# Altium project Programer_PCB.PrjPcb
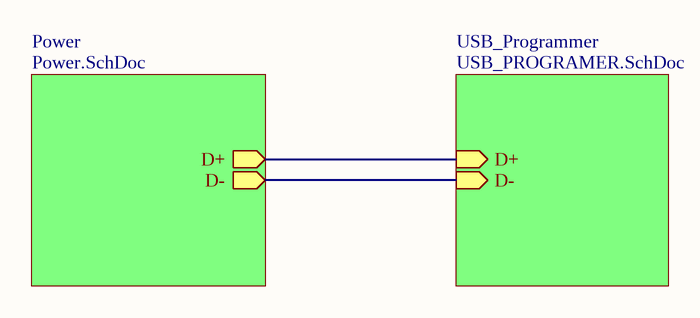
[diagram p0: Programador.SchDoc]
3 sheets, 47 parts. Net scope: hierarchical (ports join the sheet entries above them; power ports are global).
Board file: Programador_PCB.PcbDoc
Sheets:
  Programador.SchDoc
    Power = Power.SchDoc
    USB_Programmer = USB_PROGRAMER.SchDoc

## Sheet Programador.SchDoc
size A4; SheetNumber: 1; SheetTotal: 3

### Sub-sheets
Power = Power.SchDoc: D+ (out), D- (out)
USB_Programmer = USB_PROGRAMER.SchDoc: D- (in), D+ (in)

### Nets
Dataneg1: sheet Power/D-, sheet USB_Programmer/D-
Dataplus1: sheet Power/D+, sheet USB_Programmer/D+

## Sheet Power.SchDoc
size A4; SheetNumber: 3; SheetTotal: 3
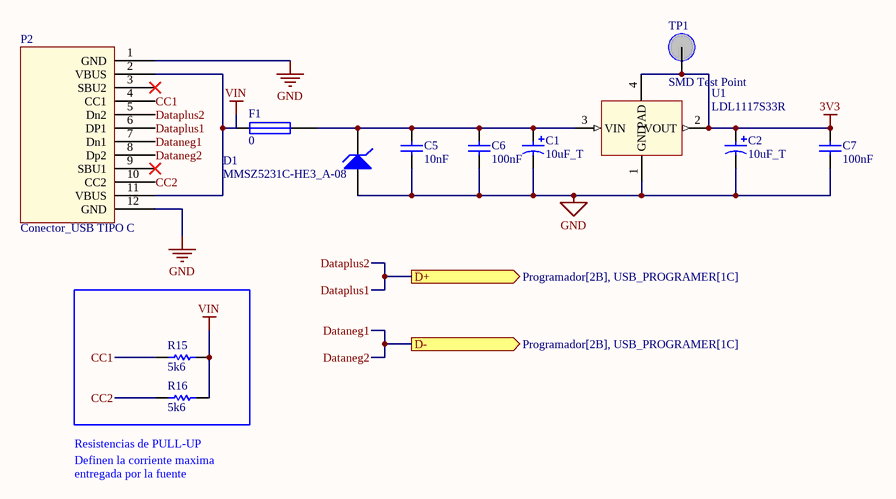
[diagram p1: Power.SchDoc]

### Parts
C1  10uF_T  [C_0805_2013_c]
C2  10uF_T  [C_0805_2013_c]
C5  10nF  [C_0805_2013_b]
C6  100nF  [C_0805_2013_b]
C7  100nF  [C_0805_2013_b]
D1  MMSZ5231C-HE3_A-08  [D_SOD-123]
F1  0  [F_0805_2012]
P2  Conector_USB TIPO C  [P_USB_C]
R15  5k6  [R_0805_2012_a]
R16  5k6  [R_0805_2012_a]
TP1  SMD Test Point  [TP SMD]
U1  LDL1117S33R  [U_SOT-223]

### Ports
D+ (out, see Programador[2B], USB_PROGRAMER[1C]), D- (out, see Programador[2B], USB_PROGRAMER[1C])

### Nets
3V3: C2.1 C7.2 TP1.1 U1.2(VOUT) U1.4(PAD)
GND: C1.2 C2.2 C5.1 C6.1 C7.1 D1.2(A) P2.1(GND) P2.12(GND) U1.1(GND)
VIN: F1.1 P2.2(VBUS) P2.11(VBUS) R15.1 R16.2
CC1: P2.4(CC1) R15.2
CC2: P2.10(CC2) R16.1
Dataneg1: P2.7(Dn1) P2.8(Dp2) ; port D-  [also labelled Dataneg2]
Dataplus1: P2.5(Dn2) P2.6(DP1) ; port D+  [also labelled Dataplus2]
NetC1_1: C1.1 C5.2 C6.2 D1.1(K) F1.2 U1.3(VIN)

Not connected (* = marked no-connect by the designer): P2 3(SBU2)* 9(SBU1)*

### Notes on the sheet
- (near R16) Resistencias de PULL-UP
- Definen la corriente maxima entregada por la fuente

### Library data of the parts
C1 C2 = C_10uF_10V_b: Capacitor SMD 0805 Tant; Manufacturer: Vishay; Manufacturer Part Number: TMCP1A106MTRF; RoHS Compliant: Yes; Supplier 1: Mouser; Supplier Part Number 1: 74-TMCP1A106MTRF; RoHS: Yes; Category: Tantalum Capacitors; Stock 1: 7293; Pricing 1: 1=0,3, 10=0,152, 50=0,152, 100=0,098, 1000=0,082, 10000=0,067 (USD); Value: 10uF_T
C5 = C_10nF_50V_b: Capacitor SMD 0805; Manufacturer: KEMET; Manufacturer Part Number: C0805C103J5RAC7210; Dielectric Material: Ceramic; Tolerance: 5%; Voltage Rating: 50V; Dielectric: X7R; Case/Package: 0805; Case Code (Imperial): 0805; Case Code (Metric): 2012; Min Operating Temperature: -55°C; Max Operating Temperature: 125°C; Packaging: Tape and Reel; Package Quantity: 10000; Voltage Rating (DC): 50V; Termination: SMD/SMT; Series: SMD Comm X7R; Length: 2mm; Lead Pitch: 0.75mm; Depth: 1.25mm; RoHS Compliant: Yes; ComponentLink1URL: http://www.mouser.com/ds/2/212/KEM_C1002_X7R_SMD-1102033.pdf?src-supplier=Mouser; ComponentLink1Description: http://www.mouser.com/ds/2/212/KEM_C1002_X7R_SMD-1102033.pdf?src-supplier=Mouser; ComponentLink2URL: http://components.arrow.com/part/dataview/3450688S9650973N7429?src-supplier=Arrow+Electronics; ComponentLink2Description: http://components.arrow.com/part/dataview/3450688S9650973N7429?src-supplier=Arrow+Electronics; ComponentLink3URL: https://datasheet.octopart.com/C0805C103J5RAC7210-KEMET-datasheet-68331906.pdf?src-supplier=Farnell; ComponentLink3Description: https://datasheet.octopart.com/C0805C103J5RAC7210-KEMET-datasheet-68331906.pdf?src-supplier=Farnell; ComponentLink4URL: https://api.kemet.com/component-edge/download/datasheet/C0805C103J5RAC7210.pdf?src-supplier=Digikey; ComponentLink4Description: https://api.kemet.com/component-edge/download/datasheet/C0805C103J5RAC7210.pdf?src-supplier=Digikey; ComponentLink5URL: https://datasheet.octopart.com/C0805C103J5RAC7210-KEMET-datasheet-37550250.pdf?src-supplier=Electro+Sonic; ComponentLink5Description: https://datasheet.octopart.com/C0805C103J5RAC7210-KEMET-datasheet-37550250.pdf?src-supplier=Electro+Sonic; ComponentLink6URL: https://datasheet.octopart.com/C0805C103J5RAC7210-KEMET-datasheet-166547538.pdf?src-supplier=TME; ComponentLink6Description: https://datasheet.octopart.com/C0805C103J5RAC7210-KEMET-datasheet-166547538.pdf?src-supplier=TME; Supplier 1: Mouser; Supplier Part Number 1: 80-C0805C103J5R7210; RoHS: Yes; Category: Ceramic Capacitors; Stock 1: 30128; Pricing 1: 1=0,1, 10=0,034, 50=0,034, 100=0,02, 1000=0,014, 10000=0,009 (USD); Value: 10nF
C6 C7 = C_100nF_50V_b: Capacitor SMD 0805; Manufacturer: Yageo; Manufacturer Part Number: CC0805KRX7R9BB104; Material: Ceramic; Tolerance: 10%; Dielectric: X7R; Voltage: 50V; Insulation Resistance: 100GR; Mounting Technology: Surface Mount; Case/Package: 0805; Pins: 2; Case Code (Metric): 2012; Case Code (Imperial): 0805; Min Operating Temperature: -55°C; Max Operating Temperature: 125°C; Packaging: Tape and Reel; Voltage Rating: 50V; Package Quantity: 4000; Termination: SMD/SMT; Series: CC; Length: 2mm; Height: 0.85mm; Depth: 1.25mm; Radiation Hardening: No; RoHS Compliant: Yes; Reach SVHC Compliant: No; Halogen Free: 5694HalogenFree; Lead Free: 5697LeadFree; ComponentLink1URL: https://datasheet.ciiva.com/11786/0900766b80d84f1d-11786009.pdf?src-supplier=Rs; ComponentLink1Description: https://datasheet.ciiva.com/11786/0900766b80d84f1d-11786009.pdf?src-supplier=Rs; ComponentLink2URL: https://datasheet.ciiva.com/46393/1734573-46393307.pdf?src-supplier=Element14; ComponentLink2Description: https://datasheet.ciiva.com/46393/1734573-46393307.pdf?src-supplier=Element14; ComponentLink3URL: https://datasheet.ciiva.com/155/mlccorderingcode-155930.pdf?src-supplier=Digikey; ComponentLink3Description: https://datasheet.ciiva.com/155/mlccorderingcode-155930.pdf?src-supplier=Digikey; ComponentLink4URL: https://datasheet.ciiva.com/155/mlccorderingcode-155929.pdf?src-supplier=Digikey; ComponentLink4Description: https://datasheet.ciiva.com/155/mlccorderingcode-155929.pdf?src-supplier=Digikey; ComponentLink5URL: https://datasheet.ciiva.com/155/mlccorderingcode-155931.pdf?src-supplier=Digikey; ComponentLink5Description: https://datasheet.ciiva.com/155/mlccorderingcode-155931.pdf?src-supplier=Digikey; ComponentLink6URL: https://datasheet.ciiva.com/11464/upy-gphc-x7r-6-3v-to-50v-8-11464757.pdf?src-supplier=Avnet; ComponentLink6Description: https://datasheet.ciiva.com/11464/upy-gphc-x7r-6-3v-to-50v-8-11464757.pdf?src-supplier=Avnet; ComponentLink7URL: https://datasheet.ciiva.com/28450/1489800-28450805.pdf?src-supplier=Element14; ComponentLink7Description: https://datasheet.ciiva.com/28450/1489800-28450805.pdf?src-supplier=Element14; ComponentLink8URL: https://datasheet.ciiva.com/29242/445210-da-01-en-kerko-chip-0805-x7r-0-1uf-10proz-50vg-29242074.pdf?src-supplier=Conrad; ComponentLink8Description: https://datasheet.ciiva.com/29242/445210-da-01-en-kerko-chip-0805-x7r-0-1uf-10proz-50vg-29242074.pdf?src-supplier=Conrad; Supplier 1: Digikey; Supplier Part Number 1: 311-1140-1-ND; RoHS: Yes; Category: Ceramic Capacitors; Stock 1: 5306374; Pricing 1: 1=0,1, 10=0,07, 50=0,0418, 100=0,0329, 500=0,02428, 1000=0,0201 (USD); Value: 100nF
D1 = D_MMSZ5231C-HE3_A-08: Diode SMD SOD-123 Zener 5V1; Manufacturer: Vishay Semiconductors; Manufacturer Part Number: MMSZ5226C-E3-08; Zener Voltage: 3.3V; Max Power Dissipation: 500mW; Impedance: 28R; Zener Current: 20mA; Voltage Tolerance: 2%; Max Reverse Leakage Current: 25uA; Mounting Technology: Surface Mount; Weight: 0.000363oz; Min Operating Temperature: -55°C; Max Operating Temperature: 150°C; Packaging: Tape and Reel; Package Quantity: 3000; Power Dissipation: 500mW; Tolerance: 2%; Series: Automotive, AEC-Q101; RoHS Compliant: Yes; ComponentLink1URL: https://www.vishay.com/docs/86344/mmsz5225_to_mmsz5267.pdf; ComponentLink1Description: Datasheet; RoHS: Yes; Category: Zener Diodes; Stock 1: 14347; Pricing 1: 1=0,29, 10=0,198, 50=0,198, 100=0,089, 1000=0,062, 10000=0,041 (USD); Value: MMSZ5231C-HE3_A-08; Supplier 1: Mouser; Supplier Part Number 1: 78-MMSZ5231CHE3_A-08
F1 = F_?_0805: (Generico) Fuse SMD 0805; Origin: TAIWAN; Published: 8-Jun-2000; LatestRevisionDate: 17-Jul-2002; LatestRevisionNote: Re-released for DXP Platform.; PackageReference: PIN-W2/E2.8; Publisher: Altium Limited; PackageDescription: Thru-Hole; 2 Leads; Supplier 1: Digi-Key; Supplier Part Number 1: SF-1206S200-2CT-ND; Value: 0
P2 = P_USB_C: Conector USB tip C basico; Value: Conector_USB TIPO C; Supplier 1: Mouser; Supplier Part Number 1: 179-UJ20CHGSMT1P16TR
R15 R16 = R_5k6_b: Resistor SMD 0805; Manufacturer: TE Connectivity; Manufacturer Part Number: CRG0805F5K6; Tolerance: 1%; Temperature Coefficient: 100ppm/°C; Power Rating: 125mW; Voltage Rating: 150V; Number of Resistors: 1; Mounting Technology: Surface Mount; Case/Package: 0805; Case Code (Imperial): 0805; Case Code (Metric): 2012; Min Operating Temperature: -55°C; Max Operating Temperature: 125°C; Packaging: Tape and Reel; Number of Terminations: 2; Series: CRG; Resistor Type: Thick Film; Termination: Solder; Technology: THICK FILM; Length: 2mm; Width: 1.25mm; Height: 0.55mm; Depth: 1.25mm; RoHS Compliant: Yes; ELV: Compliant; ComponentLink1URL: https://datasheet.ciiva.com/11809/0900766b800a696e-11809932.pdf?src-supplier=Rs; ComponentLink1Description: https://datasheet.ciiva.com/11809/0900766b800a696e-11809932.pdf?src-supplier=Rs; ComponentLink2URL: https://datasheet.ciiva.com/12563/eng-ds-1773204-g-12563327.pdf?src-supplier=Mouser; ComponentLink2Description: https://datasheet.ciiva.com/12563/eng-ds-1773204-g-12563327.pdf?src-supplier=Mouser; Supplier 1: Digikey; Supplier Part Number 1: A126380CT-ND; RoHS: Yes; Stock 1: 44154; Pricing 1: 1=0,1, 10=0,034, 50=0,0218, 100=0,0182, 500=0,01264, 1000=0,01093 (USD); Value: 5k6
TP1 = P_T_TP: Test Point SMD; Origin: CHINA; Published: 8-Jun-2000; LatestRevisionDate: 17-Jul-2002; LatestRevisionNote: Re-released for DXP Platform.; PackageReference: AXIAL-0.3; Publisher: Altium Limited; PackageDescription: Axial Device, Thru-Hole; 2 Leads; 0.3 in Pin Spacing; Supplier 1: Mouser; Supplier Part Number 1: 279-RCT-0C; Type: CONNECTOR; Value: SMD Test Point
U1 = U_LDL1117: LDL1117 Series 1.2 A 2.5 V High PSRR LDO Linear Voltage Regulator-SOT-223; Manufacturer: STMicroelectronics; Manufacturer Part Number: LDL1117S25R; Output Type: Fixed; Output Configuration: Positive; Number of Regulators: 1; Max Supply Voltage: 18V; Min Output Voltage: 2.5V; Output Current: 1.2A; Quiescent Current: 500uA; Power Supply Rejection Ratio (PSRR): 65dB; Accuracy: 2%; Min Supply Voltage: 2.6V; Nominal Supply Current: 250uA; Number of Channels: 1NUMBER; Value: LDL1117S25R; Mounting Technology: Surface Mount; Case/Package: TO-261-4; Min Operating Temperature: -40°C; Max Operating Temperature: 125°C; Packaging: Cut Tape; Series: -; Number of Outputs: 1NUMBER; Output Voltage: 2.5V; Height: 1.8mm; RoHS Compliant: Yes; ComponentLink1URL: http://www.farnell.com/datasheets/2342741.pdf?src-supplier=Farnell; ComponentLink1Description: http://www.farnell.com/datasheets/2342741.pdf?src-supplier=Farnell; ComponentLink2URL: http://www.st.com/content/ccc/resource/technical/document/datasheet/group3/0e/5a/00/ca/10/1a/4f/a5/DM00366442/files/DM00366442.pdf/jcr:content/translations/en.DM00366442.pdf?src-supplier=Digikey; ComponentLink2Description: http://www.st.com/content/ccc/resource/technical/document/datasheet/group3/0e/5a/00/ca/10/1a/4f/a5/DM00366442/files/DM00366442.pdf/jcr:content/translations/en.DM00366442.pdf?src-supplier=Digikey; ComponentLink3URL: https://datasheet.octopart.com/LDL1117S25R-STMicroelectronics-datasheet-165583407.pdf?src-supplier=TME; ComponentLink3Description: https://datasheet.octopart.com/LDL1117S25R-STMicroelectronics-datasheet-165583407.pdf?src-supplier=TME; Supplier 1: Mouser; Supplier Part Number 1: 511-LDL1117S25R; RoHS: Yes; Category: Voltage Regulators - Linear; Stock 1: 10345; Pricing 1: 1=1,1, 10=0,98, 50=0,935, 100=0,757, 1000=0,478, 10000=0,415 (USD)

## Sheet USB_PROGRAMER.SchDoc
size A4; SheetNumber: 2; SheetTotal: 3
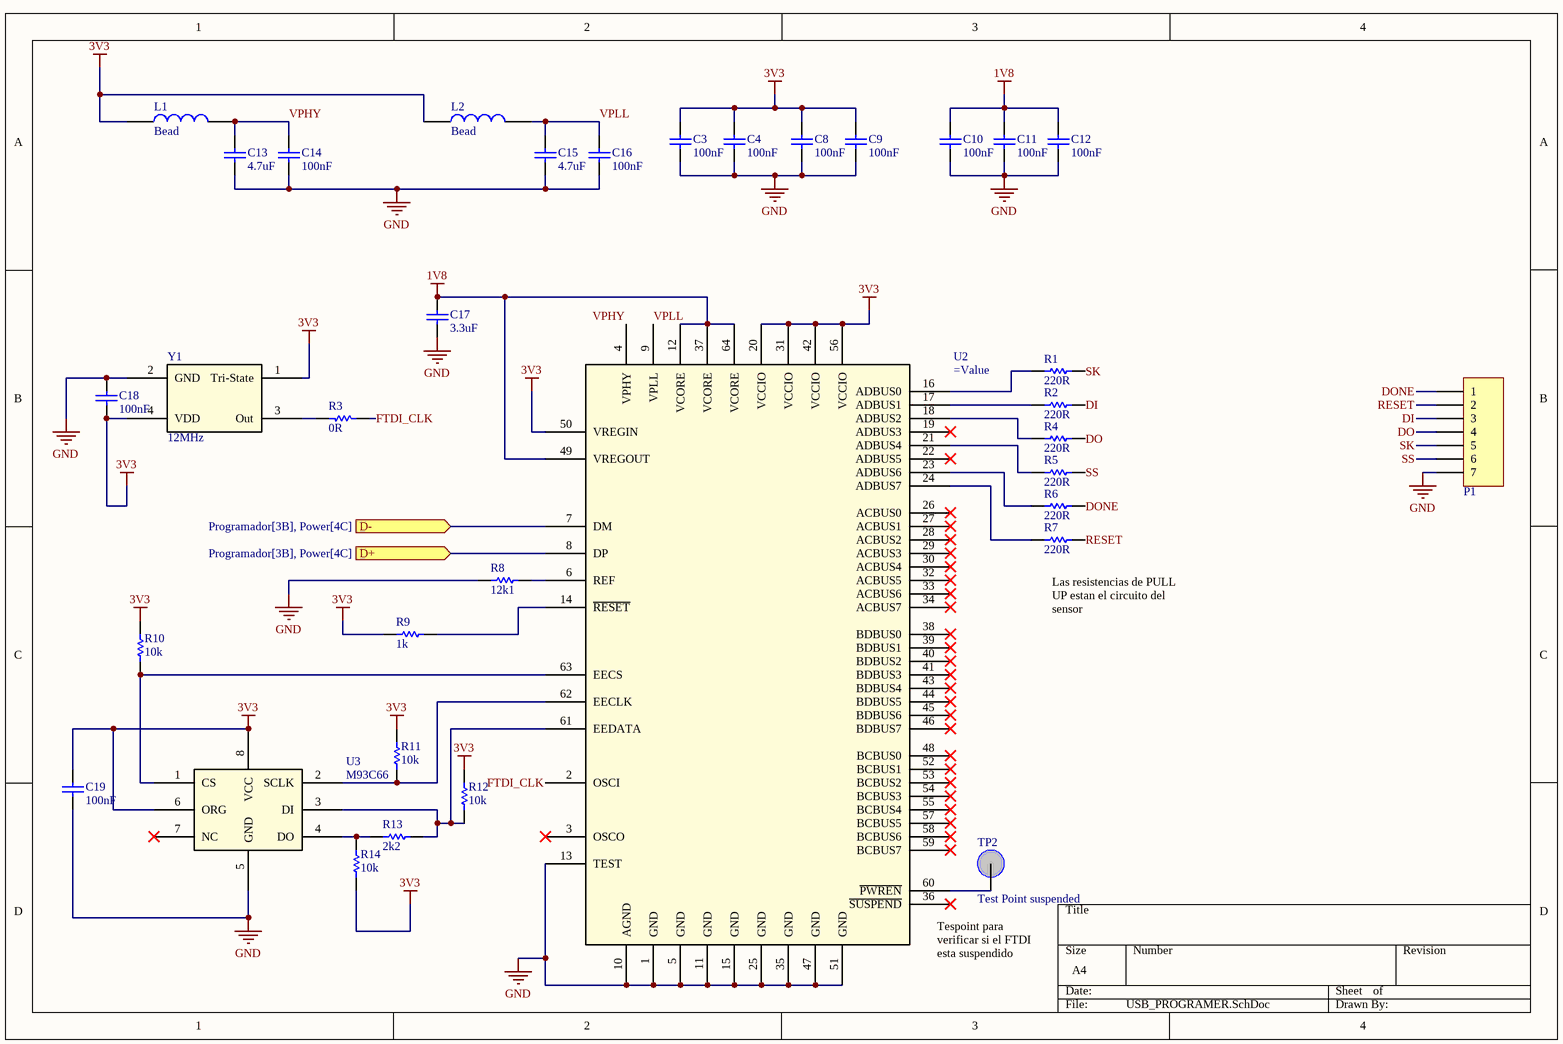
[diagram p2: USB_PROGRAMER.SchDoc]

### Parts
C3  100nF  [C_0805_2013_b]
C4  100nF  [C_0805_2013_b]
C8  100nF  [C_0805_2013_b]
C9  100nF  [C_0805_2013_b]
C10  100nF  [C_0805_2013_b]
C11  100nF  [C_0805_2013_b]
C12  100nF  [C_0805_2013_b]
C13  4.7uF  [C_0805_2013_b]
C14  100nF  [C_0805_2013_b]
C15  4.7uF  [C_0805_2013_b]
C16  100nF  [C_0805_2013_b]
C17  3.3uF  [C_0805_2013_b]
C18  100nF  [C_0805_2013_b]
C19  100nF  [C_0805_2013_b]
L1  Bead  [L_0805_2013]
L2  Bead  [L_0805_2013]
P1  BORNERA 6 ENCH  [P_CON1X7]  (value not drawn)
R1  220R  [R_0805_2012_a]
R2  220R  [R_0805_2012_a]
R3  0R  [R_0805_2012_a]
R4  220R  [R_0805_2012_a]
R5  220R  [R_0805_2012_a]
R6  220R  [R_0805_2012_a]
R7  220R  [R_0805_2012_a]
R8  12k1  [R_0805_2012_a]
R9  1k  [R_0805_2012_a]
R10  10k  [R_0805_2012_a]
R11  10k  [R_0805_2012_a]
R12  10k  [R_0805_2012_a]
R13  2k2  [R_0805_2012_a]
R14  10k  [R_0805_2012_a]
TP2  Test Point suspended  [TP SMD]
U2  (no value)  [U_TQFP-64]
U3  M93C66  [U_SO-8]
Y1  12MHz  [Y_SMD-XTAL-12MHz]

### Ports
D+ (in, see Programador[3B], Power[4C]), D- (in, see Programador[3B], Power[4C])

### Nets
1V8: C10.2 C11.2 C12.2 C17.2 U2.12(VCORE) U2.37(VCORE) U2.49(VREGOUT) U2.64(VCORE)
3V3: C3.2 C4.2 C8.2 C9.2 C18.1 C19.2 L1.1 L2.1 R9.1 R10.2 R11.2 R12.2 R14.1 U2.20(VCCIO) U2.31(VCCIO) U2.42(VCCIO) U2.50(VREGIN) U2.56(VCCIO) U3.6(ORG) U3.8(VCC) Y1.1(Tri-State) Y1.4(VDD)
GND: C3.1 C4.1 C8.1 C9.1 C10.1 C11.1 C12.1 C13.1 C14.1 C15.1 C16.1 C17.1 C18.2 C19.1 P1.7 R8.1 U2.1(GND) U2.5(GND) U2.10(AGND) U2.11(GND) U2.13(TEST) U2.15(GND) U2.25(GND) U2.35(GND) U2.47(GND) U2.51(GND) U3.5(GND) Y1.2(GND)
Dataneg1: U2.7(DM) ; port D-
Dataplus1: U2.8(DP) ; port D+
DI: P1.3 R2.2
DO: P1.4 R4.2
DONE: P1.1 R6.2
FTDI_CLK: R3.1 U2.2(OSCI)
RESET: P1.2 R7.2
SK: P1.5 R1.2
SS: P1.6 R5.2
VPHY: C13.2 C14.2 L1.2 U2.4(VPHY)
VPLL: C15.2 C16.2 L2.2 U2.9(VPLL)
NetR1_1: R1.1 U2.16(ADBUS0)
NetR2_1: R2.1 U2.17(ADBUS1)
NetR3_2: R3.2 Y1.3(Out)
NetR4_1: R4.1 U2.18(ADBUS2)
NetR5_1: R5.1 U2.21(ADBUS4)
NetR6_1: R6.1 U2.23(ADBUS6)
NetR7_1: R7.1 U2.24(ADBUS7)
NetR8_2: R8.2 U2.6(REF)
NetR9_2: R9.2 U2.14(~{RESET})
NetR10_1: R10.1 U2.63(EECS) U3.1(CS)
NetR11_1: R11.1 U2.62(EECLK) U3.2(SCLK)
NetR12_1: R12.1 R13.2 U2.61(EEDATA) U3.3(DI)
NetR13_1: R13.1 R14.2 U3.4(DO)
NetTP2_1: TP2.1 U2.60(~{PWREN})

Not connected (* = marked no-connect by the designer): U2 3(OSCO)* 19(ADBUS3)* 22(ADBUS5)* 26(ACBUS0)* 27(ACBUS1)* 28(ACBUS2)* 29(ACBUS3)* 30(ACBUS4)* 32(ACBUS5)* 33(ACBUS6)* 34(ACBUS7)* 36(~{SUSPEND})* 38(BDBUS0)* 39(BDBUS1)* 40(BDBUS2)* 41(BDBUS3)* 43(BDBUS4)* 44(BDBUS5)* 45(BDBUS6)* 46(BDBUS7)* 48(BCBUS0)* 52(BCBUS1)* 53(BCBUS2)* 54(BCBUS3)* 55(BCBUS4)* 57(BCBUS5)* 58(BCBUS6)* 59(BCBUS7)*; U3 7(NC)*

### Notes on the sheet
- (near R7) Las resistencias de PULL UP estan el circuito del sensor
- (near U2) Tespoint para verificar si el FTDI esta suspendido

### Library data of the parts
C3 C4 C8-C12 C14 C16 C18 C19 = C_100nF_50V_b: as C6 on sheet Power; Mounting Technology: Surface Mount; Case/Package: 0805; Pins: 2; Case Code (Metric): 2012; Case Code (Imperial): 0805; Min Operating Temperature: -55°C; Max Operating Temperature: 125°C; Packaging: Tape and Reel; Voltage Rating: 50V; Package Quantity: 4000; Termination: SMD/SMT; Series: CC; Length: 2mm; Height: 0.85mm; Depth: 1.25mm; Radiation Hardening: No; RoHS Compliant: Yes; Reach SVHC Compliant: No; Halogen Free: 5694HalogenFree; Lead Free: 5697LeadFree; ComponentLink1URL: https://datasheet.ciiva.com/11786/0900766b80d84f1d-11786009.pdf?src-supplier=Rs; ComponentLink1Description: https://datasheet.ciiva.com/11786/0900766b80d84f1d-11786009.pdf?src-supplier=Rs; ComponentLink2URL: https://datasheet.ciiva.com/46393/1734573-46393307.pdf?src-supplier=Element14; ComponentLink2Description: https://datasheet.ciiva.com/46393/1734573-46393307.pdf?src-supplier=Element14; ComponentLink3URL: https://datasheet.ciiva.com/155/mlccorderingcode-155930.pdf?src-supplier=Digikey; ComponentLink3Description: https://datasheet.ciiva.com/155/mlccorderingcode-155930.pdf?src-supplier=Digikey; ComponentLink4URL: https://datasheet.ciiva.com/155/mlccorderingcode-155929.pdf?src-supplier=Digikey; ComponentLink4Description: https://datasheet.ciiva.com/155/mlccorderingcode-155929.pdf?src-supplier=Digikey; ComponentLink5URL: https://datasheet.ciiva.com/155/mlccorderingcode-155931.pdf?src-supplier=Digikey; ComponentLink5Description: https://datasheet.ciiva.com/155/mlccorderingcode-155931.pdf?src-supplier=Digikey; ComponentLink6URL: https://datasheet.ciiva.com/11464/upy-gphc-x7r-6-3v-to-50v-8-11464757.pdf?src-supplier=Avnet; ComponentLink6Description: https://datasheet.ciiva.com/11464/upy-gphc-x7r-6-3v-to-50v-8-11464757.pdf?src-supplier=Avnet; ComponentLink7URL: https://datasheet.ciiva.com/28450/1489800-28450805.pdf?src-supplier=Element14; ComponentLink7Description: https://datasheet.ciiva.com/28450/1489800-28450805.pdf?src-supplier=Element14; ComponentLink8URL: https://datasheet.ciiva.com/29242/445210-da-01-en-kerko-chip-0805-x7r-0-1uf-10proz-50vg-29242074.pdf?src-supplier=Conrad; ComponentLink8Description: https://datasheet.ciiva.com/29242/445210-da-01-en-kerko-chip-0805-x7r-0-1uf-10proz-50vg-29242074.pdf?src-supplier=Conrad; Supplier 1: Digikey; Supplier Part Number 1: 311-1140-1-ND; RoHS: Yes; Category: Ceramic Capacitors; Stock 1: 5306374; Pricing 1: 1=0,1, 10=0,07, 50=0,0418, 100=0,0329, 500=0,02428, 1000=0,0201 (USD); Value: 100nF
C13 C15 = C_4.7uF_10V_b: (Modificar) Capacitor SMD 0805; Value: 4.7uF
C17 = C_?F_?_b: (Generico) Capacitor SMD 0805; Value: 0
L1 L2 = L_Bead: Inductor SMD 0805; Manufacturer: Pulse; Manufacturer Part Number: PE-0805PFB600ST; Number of Lines: 1; Max Current Rating: 3A; Mounting Technology: Surface Mount; Case/Package: 0805; Case Code (Metric): 2012; Case Code (Imperial): 0805; Min Operating Temperature: -40°C; Max Operating Temperature: 105°C; Package Quantity: 4000; Packaging: Cut Tape; Series: PFB; Length: 0.079inch; Width: 0.049inch; Height: 0.041inch; RoHS Compliant: Yes; ComponentLink1URL: https://productfinder.pulseeng.com/doc_type/WEB301/doc_num/WC706/doc_part/WC706.pdf?src-supplier=Digikey; ComponentLink1Description: https://productfinder.pulseeng.com/doc_type/WEB301/doc_num/WC706/doc_part/WC706.pdf?src-supplier=Digikey; ComponentLink2URL: http://productfinder.pulseeng.com/products/datasheets/WC706.pdf?src-supplier=Digikey; ComponentLink2Description: http://productfinder.pulseeng.com/products/datasheets/WC706.pdf?src-supplier=Digikey; Supplier 1: Mouser; Supplier Part Number 1: 673-PE-0805PFB600ST; RoHS: Yes; Category: Ferrite Beads and Chips; Stock 1: 58506; Pricing 1: 1=0,1, 10=0,051, 50=0,051, 100=0,035, 1000=0,025, 10000=0,02 (USD); Value: Bead
P1 = P_BORNERA 7: Bornera 7; Value: BORNERA 6 ENCH
R1 R2 R4-R7 = R_220R_b: Resistor SMD 0805; Manufacturer: Bourns; Manufacturer Part Number: CR0805-FX-2200ELF; Tolerance: 1%; Power Rating: 125mW; Voltage Rating: 150V; Temperature Coefficient: 100ppm/°C; Mounting Technology: Surface Mount; Case/Package: 0805; Case Code (Metric): 2012; Case Code (Imperial): 0805; Contact Plating: Tin; Min Operating Temperature: -55°C; Max Operating Temperature: 155°C; Package Quantity: 5000; Packaging: Tape and Reel; Number of Terminations: 2; Termination: SMD/SMT; Max Power Dissipation: 125mW; Features: Moisture Resistant; Series: CR0805; Length: 2mm; Width: 1.25mm; Height: 0.5mm; Thickness: 508um; Radiation Hardening: No; RoHS Compliant: Yes; ComponentLink1URL: https://datasheet.ciiva.com/5540/chpreztr-5540846.pdf?src-supplier=Mouser; ComponentLink1Description: https://datasheet.ciiva.com/5540/chpreztr-5540846.pdf?src-supplier=Mouser; Supplier 1: Digikey; Supplier Part Number 1: CR0805-FX-2200ELFCT-ND; RoHS: Yes; Category: Chip SMD Resistors; Stock 1: 162372; Pricing 1: 1=0,1, 10=0,021, 50=0,0132, 100=0,011, 500=0,00744, 1000=0,00639 (USD); Value: 220R
R3 = R_0R_b: Resistor SMD 0805; Manufacturer: Stackpole Electronics; Manufacturer Part Number: RMCF0805ZT0R00; Power Rating: 125mW; Temperature Coefficient: 200ppm/°C; Voltage Rating: 150V; Mounting Technology: Surface Mount; Case/Package: 0805; Case Code (Metric): 2012; Case Code (Imperial): 0805; Contact Plating: Tin,Matte; Min Operating Temperature: -55°C; Max Operating Temperature: 155°C; Packaging: Tape and Reel; Number of Terminations: 2; Max Power Dissipation: 125mW; Features: Automotive AEC-Q200; Series: RMCF; Construction: Rectangular; Length: 2mm; Width: 0.049inch; Height: 0.026inch; Depth: 1.25mm; Ratings: AEC-Q200; Radiation Hardening: No; Lead Free: Lead Free; Military Standard: Not; RoHS Compliant: Yes; ComponentLink1URL: https://datasheet.ciiva.com/15193/getdatasheetpartid-360417-15193658.pdf?src-supplier=Verical; ComponentLink1Description: https://datasheet.ciiva.com/15193/getdatasheetpartid-360417-15193658.pdf?src-supplier=Verical; Supplier 1: Digikey; Supplier Part Number 1: RMCF0805ZT0R00CT-ND; RoHS: Yes; Category: Chip SMD Resistors; Stock 1: 1321891; Pricing 1: 1=0,1, 10=0,017, 25=0,0128, 50=0,0096, 100=0,0068, 250=0,00544, 500=0,00436, 1000=0,00321 (USD); Value: 0R
R8 = R_12k1_b: Resistor SMD 0805; Manufacturer: Stackpole Electronics; Manufacturer Part Number: RMCF0805FT12K1; Tolerance: 1%; Power Rating: 125mW; Temperature Coefficient: 100ppm/°C; Mounting Technology: Surface Mount; Case/Package: 0805; Case Code (Metric): 2012; Case Code (Imperial): 0805; Contact Plating: Tin,Matte; Min Operating Temperature: -55°C; Max Operating Temperature: 155°C; Packaging: Tape and Reel; Number of Terminations: 2; Max Power Dissipation: 125mW; Features: Automotive AEC-Q200; Series: RMCF; Construction: Rectangular; Length: 0.079inch; Width: 0.049inch; Height: 0.026inch; Depth: 1.25mm; Ratings: AEC-Q200; Radiation Hardening: No; Lead Free: Lead Free; Military Standard: Not; RoHS Compliant: Yes; ComponentLink1URL: https://datasheet.ciiva.com/15193/getdatasheetpartid-483936-15193530.pdf?src-supplier=Verical; ComponentLink1Description: https://datasheet.ciiva.com/15193/getdatasheetpartid-483936-15193530.pdf?src-supplier=Verical; Supplier 1: Digikey; Supplier Part Number 1: RMCF0805FT12K1CT-ND; RoHS: Yes; Category: Chip SMD Resistors; Stock 1: 644845; Pricing 1: 1=0,1, 10=0,02, 50=0,0124, 100=0,0103, 500=0,007, 1000=0,00601 (USD); Value: 12k1
R9 = R_1k_b: Resistor SMD 0805; Manufacturer: Bourns; Manufacturer Part Number: CR0805-FX-1001ELF; Tolerance: 1%; Temperature Coefficient: 100ppm/°C; Power Rating: 125mW; Voltage Rating: 150V; Mounting Technology: Surface Mount; Case/Package: 0805; Pins: 2; Contact Plating: Tin; Case Code (Imperial): 0805; Case Code (Metric): 2012; Min Operating Temperature: -55°C; Max Operating Temperature: 155°C; Resistor Type: Thick Film; Packaging: Tape and Reel; Package Quantity: 5000; Termination: SMD/SMT; Number of Terminations: 2; Max Power Dissipation: 125mW; Voltage Rating (DC): 150V; Features: Moisture Resistant; Series: CR0805; Resistance Tolerance: 1%; Technology: THICK FILM; Length: 2mm; Width: 1.25mm; Height: 0.5mm; Depth: 1.25mm; Thickness: 508um; Radiation Hardening: No; Reach SVHC Compliant: No; RoHS Compliant: Yes; ComponentLink1URL: https://datasheet.ciiva.com/11810/0900766b80fcdb72-11810305.pdf?src-supplier=Rs; ComponentLink1Description: https://datasheet.ciiva.com/11810/0900766b80fcdb72-11810305.pdf?src-supplier=Rs; ComponentLink2URL: https://datasheet.ciiva.com/27049/775383-27049976.pdf?src-supplier=Jameco; ComponentLink2Description: https://datasheet.ciiva.com/27049/775383-27049976.pdf?src-supplier=Jameco; ComponentLink3URL: https://datasheet.ciiva.com/7986/1856384-7986222.pdf?src-supplier=Element14; ComponentLink3Description: https://datasheet.ciiva.com/7986/1856384-7986222.pdf?src-supplier=Element14; ComponentLink4URL: https://datasheet.ciiva.com/9123/chpreztr-9123643.pdf?src-supplier=Avnet; ComponentLink4Description: https://datasheet.ciiva.com/9123/chpreztr-9123643.pdf?src-supplier=Avnet; ComponentLink5URL: https://datasheet.ciiva.com/6547/chpreztr-6547422.pdf?src-supplier=Digikey; ComponentLink5Description: https://datasheet.ciiva.com/6547/chpreztr-6547422.pdf?src-supplier=Digikey; ComponentLink6URL: https://datasheet.ciiva.com/6547/chpreztr-6547423.pdf?src-supplier=Digikey; ComponentLink6Description: https://datasheet.ciiva.com/6547/chpreztr-6547423.pdf?src-supplier=Digikey; ComponentLink7URL: https://datasheet.ciiva.com/6547/chpreztr-6547421.pdf?src-supplier=Digikey; ComponentLink7Description: https://datasheet.ciiva.com/6547/chpreztr-6547421.pdf?src-supplier=Digikey; ComponentLink8URL: https://datasheet.ciiva.com/30129/159chpreztr-30129981.pdf?src-supplier=Onlinecomponents.com; ComponentLink8Description: https://datasheet.ciiva.com/30129/159chpreztr-30129981.pdf?src-supplier=Onlinecomponents.com; ComponentLink9URL: https://datasheet.ciiva.com/46394/691949-46394380.pdf?src-supplier=Element14; ComponentLink9Description: https://datasheet.ciiva.com/46394/691949-46394380.pdf?src-supplier=Element14; ComponentLink10URL: https://datasheet.ciiva.com/16722/70154685-16722677.pdf?src-supplier=Allied+Electronics; ComponentLink10Description: https://datasheet.ciiva.com/16722/70154685-16722677.pdf?src-supplier=Allied+Electronics; ComponentLink11URL: https://datasheet.ciiva.com/48692/001055506-da-01-en-smd-wid-cr0805-fx-1001elf-1k-ohm-1-8w-48692106.pdf?src-supplier=Conrad; ComponentLink11Description: https://datasheet.ciiva.com/48692/001055506-da-01-en-smd-wid-cr0805-fx-1001elf-1k-ohm-1-8w-48692106.pdf?src-supplier=Conrad; Supplier 1: Digikey; Supplier Part Number 1: CR0805-FX-1001ELFCT-ND; RoHS: Yes; Category: Chip SMD Resistors; Stock 1: 453972; Pricing 1: 1=0,1, 10=0,021, 50=0,0132, 100=0,011, 500=0,00744, 1000=0,00639 (USD); Value: 1k
R10-R12 R14 = R_10k_b: Resistor SMD 0805; Manufacturer: Yageo; Manufacturer Part Number: AC0805FR-0710KL; Tolerance: 1%; Power Rating: 125mW; Voltage Rating: 150V; Temperature Coefficient: 100ppm/°C; Case/Package: 0805; Case Code (Metric): 2012; Case Code (Imperial): 0805; Min Operating Temperature: -55°C; Max Operating Temperature: 155°C; Packaging: Tape and Reel; Package Quantity: 1; Number of Terminations: 2; Termination: SMD/SMT; Max Power Dissipation: 125mW; Features: Moisture Resistant,Automotive AEC-Q200,Anti-Sulfur; Series: AC; Construction: Rectangular; Length: 0.079inch; Width: 0.049inch; Height: 0.024inch; Depth: 1.25mm; Military Standard: Not; Lead Free: Lead Free; RoHS Compliant: Yes; ComponentLink1URL: http://www.yageo.com/NewPortal/yageodocoutput?fileName=/pdf/R-Chip/PYu-AC_51_RoHS_L_6.pdf&src-supplier=Digikey; ComponentLink1Description: http://www.yageo.com/NewPortal/yageodocoutput?fileName=/pdf/R-Chip/PYu-AC_51_RoHS_L_6.pdf&src-supplier=Digikey; ComponentLink2URL: http://www.yageo.com/documents/recent/PYu-AC_51_RoHS_L_2_revised.pdf?src-supplier=Future+Electronics; ComponentLink2Description: http://www.yageo.com/documents/recent/PYu-AC_51_RoHS_L_2_revised.pdf?src-supplier=Future+Electronics; ComponentLink3URL: http://www.yageo.com/NewPortal/yageodocoutput?fileName=/pdf/R-Chip/PYu-AC_51_RoHS_L_6.pdf&src-supplier=NAC+Semi; ComponentLink3Description: http://www.yageo.com/NewPortal/yageodocoutput?fileName=/pdf/R-Chip/PYu-AC_51_RoHS_L_6.pdf&src-supplier=NAC+Semi; ComponentLink4URL: http://www.yageo.com/NewPortal/yageodocoutput?fileName=/pdf/R-Chip/PYu-AC_51_RoHS_L_6.pdf&src-supplier=Rutronik; ComponentLink4Description: http://www.yageo.com/NewPortal/yageodocoutput?fileName=/pdf/R-Chip/PYu-AC_51_RoHS_L_6.pdf&src-supplier=Rutronik; Supplier 1: Digikey; Supplier Part Number 1: 311-10KLGCT-ND; RoHS: Yes; Category: Chip SMD Resistors; Stock 1: 480247; Pricing 1: 1=0,1, 10=0,031, 50=0,0198, 100=0,0166, 500=0,01152, 1000=0,00997 (USD); Value: 10k
R13 = R_2k2_b: Resistor SMD 0805; Manufacturer: Bourns; Manufacturer Part Number: CR0805-FX-2201ELF; Voltage Rating: 150V; Tolerance: 1%; Power Rating: 125mW; Temperature Coefficient: 100ppm/°C; Mounting Technology: Surface Mount; Case/Package: 0805; Contact Plating: Tin; Case Code (Imperial): 0805; Case Code (Metric): 2012; Min Operating Temperature: -55°C; Max Operating Temperature: 155°C; Packaging: Tape and Reel; Package Quantity: 5000; Termination: SMD/SMT; Series: CR0805; Resistor Type: Thick Film; Voltage Rating (DC): 150V; Resistance Tolerance: 1%; Length: 2mm; Width: 1.25mm; Height: 0.5mm; Thickness: 508um; Radiation Hardening: No; RoHS Compliant: Yes; Reach SVHC Compliant: No; ComponentLink1URL: https://datasheet.ciiva.com/22713/691949-22713256.pdf?src-supplier=Element14; ComponentLink1Description: https://datasheet.ciiva.com/22713/691949-22713256.pdf?src-supplier=Element14; ComponentLink2URL: https://datasheet.ciiva.com/5541/chpreztr-5541000.pdf?src-supplier=Mouser; ComponentLink2Description: https://datasheet.ciiva.com/5541/chpreztr-5541000.pdf?src-supplier=Mouser; Supplier 1: Digikey; Supplier Part Number 1: 118-CR0805-FX-2201ELFCT-ND; RoHS: Yes; Category: Chip SMD Resistors; Stock 1: 80126; Pricing 1: 1=0,1, 10=0,021, 50=0,0132, 100=0,011, 500=0,00744, 1000=0,00639 (USD); Value: 2k2
TP2 = P_T_TP: Test Point SMD; Origin: CHINA; Published: 8-Jun-2000; LatestRevisionDate: 17-Jul-2002; LatestRevisionNote: Re-released for DXP Platform.; PackageReference: AXIAL-0.3; Publisher: Altium Limited; PackageDescription: Axial Device, Thru-Hole; 2 Leads; 0.3 in Pin Spacing; Supplier 1: Mouser; Supplier Part Number 1: 279-RCT-0C; Type: CONNECTOR; Value: Test Point suspended
U2 = U_FT2232H: Supplier 1: Digikey; Supplier Part Number 1: 768-1347-ND; Supplier 2: Arrow Electronics; Supplier Part Number 2: FT2232D-TRAY
U3 = U_M93C66: Supplier 1: Arrow Electronics; Supplier Part Number 1: M93C66-WMN6TP
Y1 = Y_12MHZ: Supplier 1: Digikey; Supplier Part Number 1: XC2882CT-ND

## Nets that join several sheets
3V3: Power (5 pins), USB_PROGRAMER (22 pins)
GND: Power (9 pins), USB_PROGRAMER (28 pins)
Dataneg1: Power (P2.7 P2.8), USB_PROGRAMER (U2.7)
Dataplus1: Power (P2.5 P2.6), USB_PROGRAMER (U2.8)